# Altium project ETR_CELLMETER_MASTER.PrjPcb (part 1 of 3)
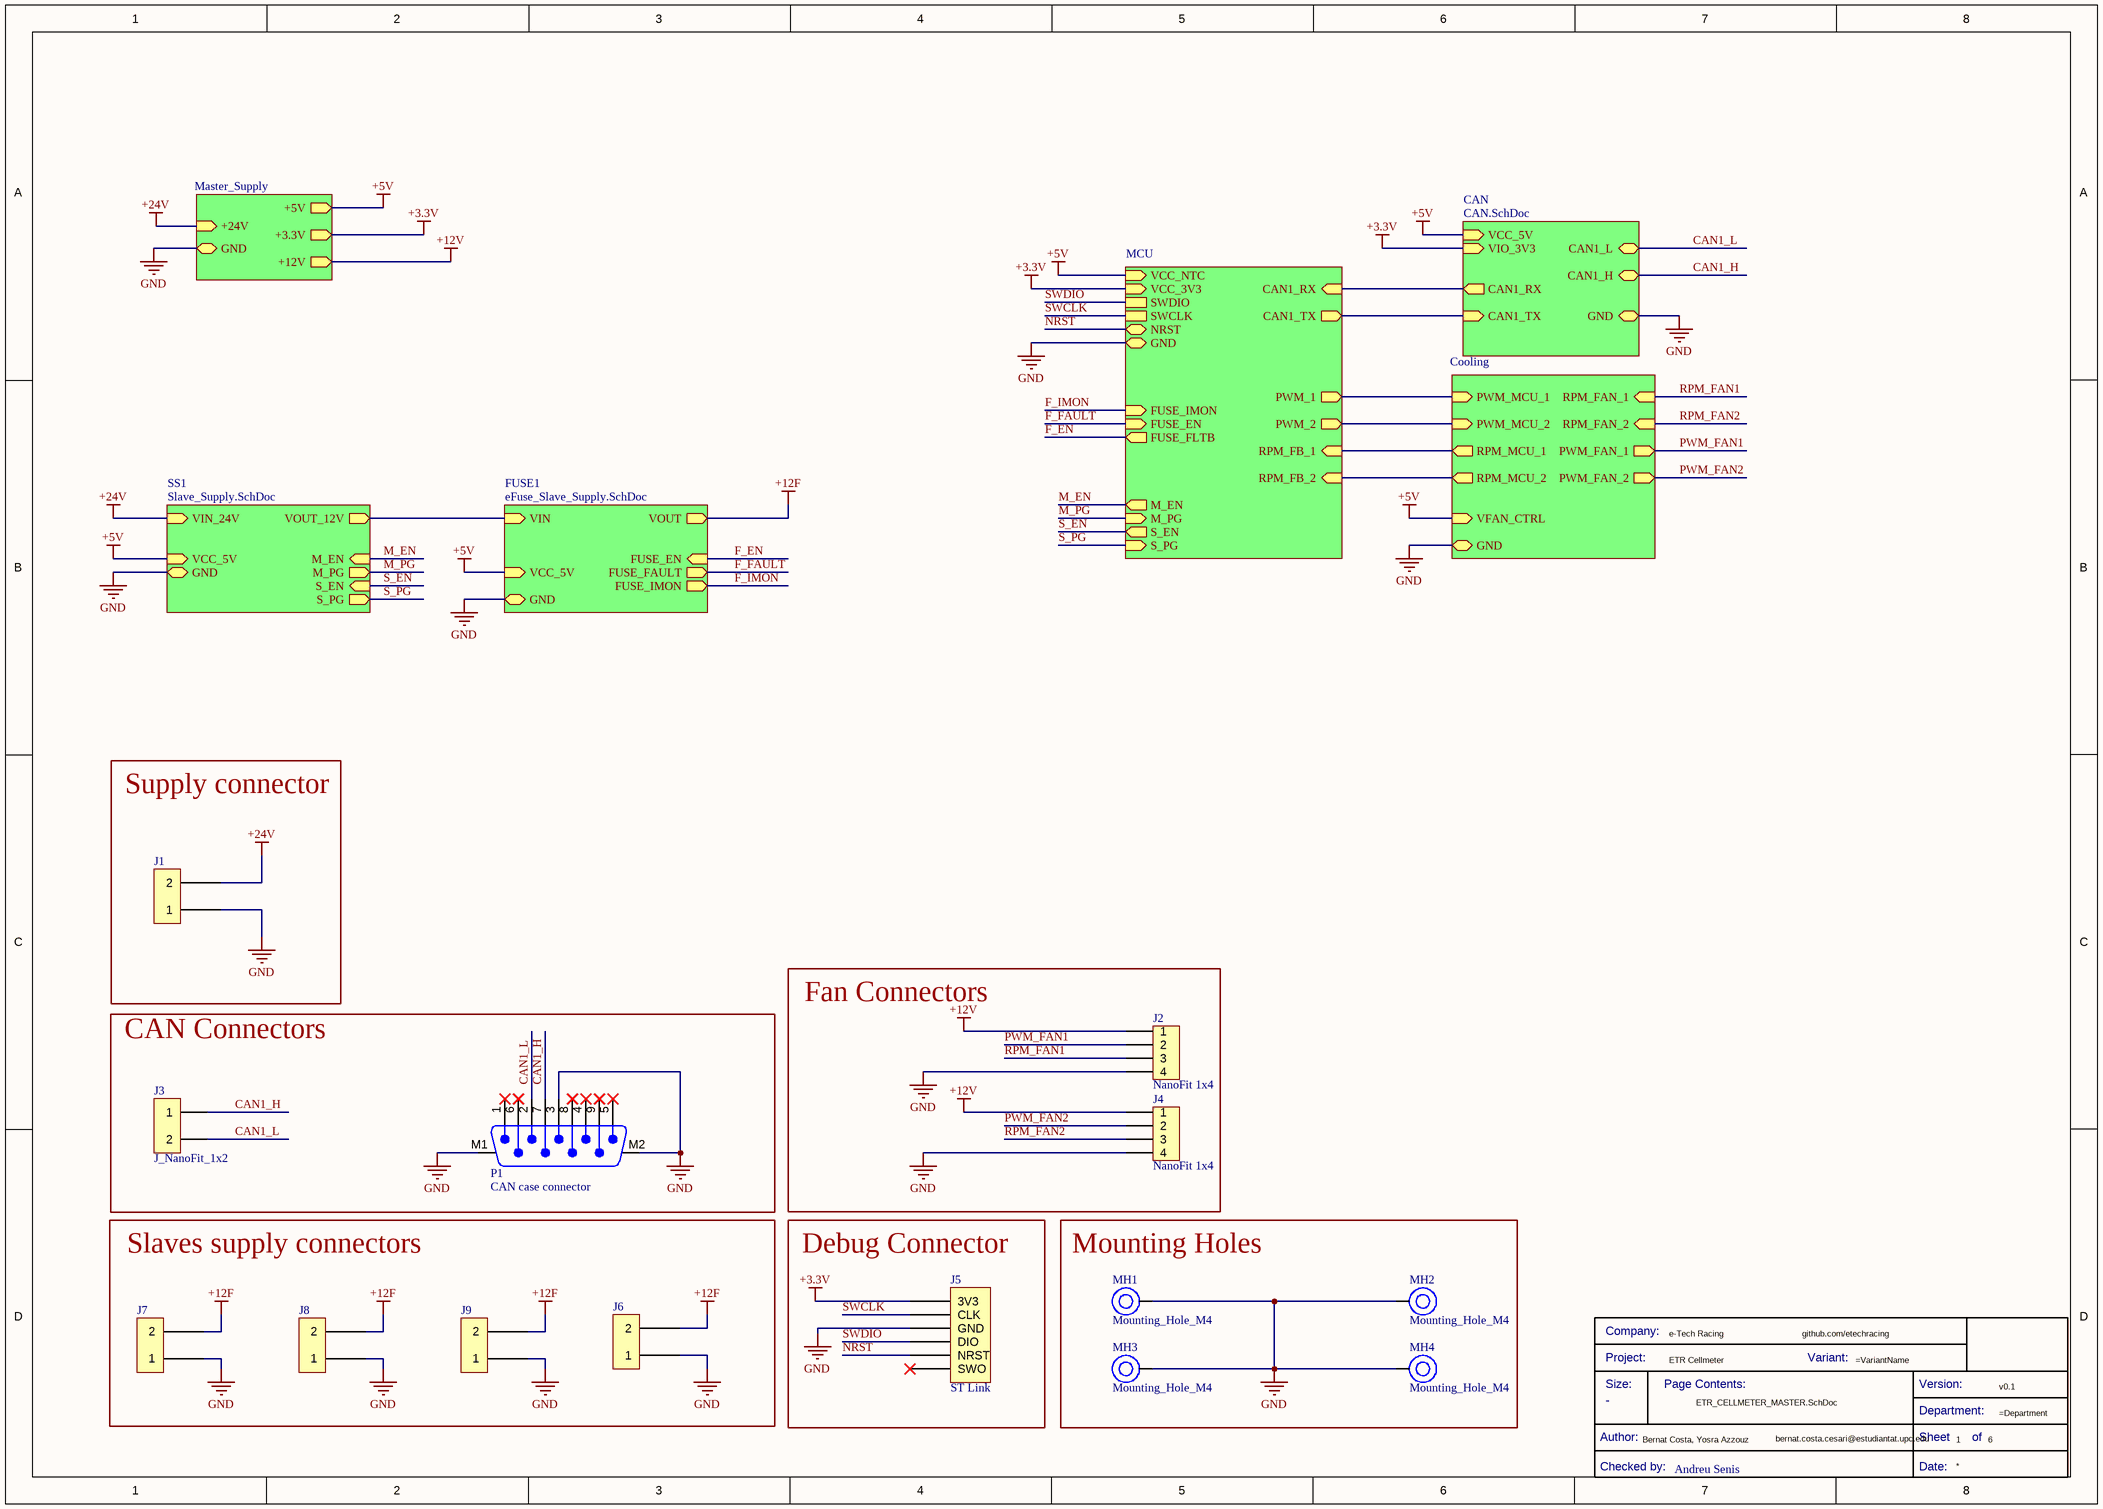
[diagram p0: ETR_CELLMETER_MASTER.SchDoc]
Company: e-Tech Racing; Date: 22/09/2024; Departament: ECUs; DesignedByURL: github.com/etechracing; DesignerMail: bernat.costa.cesari@estudiantat.upc.edu; DesignerName: Bernat Costa, Yosra Azzouz; Project: ETR Cellmeter; ReviewerName: Andreu Senis; Size: A4; Variant: 0; Version: v0.1
7 sheets, 188 parts. Net scope: strictly hierarchical (ports join the sheet entries above them; power ports are local).
Board file: ETR_CELLMETER_MASTER.PcbDoc
Sheets:
  ETR_CELLMETER_MASTER.SchDoc
    Master_Supply = Master_Supply.SchDoc
    MCU = MCU.SchDoc
    Cooling = Cooling.SchDoc
    SS1 = Slave_Supply.SchDoc
    FUSE1 = eFuse_Slave_Supply.SchDoc
    CAN = CAN.SchDoc

## Sheet ETR_CELLMETER_MASTER.SchDoc
size A3; DocumentNumber: 1; SheetNumber: 1; SheetTotal: 6

### Parts
(Parts that share a designator on the sheet are numbered #1, #2 ... from top to bottom, then left to right.)
*#1  Checked by:: Andreu Senis  (hidden comment: Title Block_template)  (graphical)
J1  J_2x1_14A_TE  [179838-2]  (value not drawn)
J2  NanoFit 1x4  [J_NanoFit_1x4_V]
J3  J_NanoFit_1x2  [FP-105309-1102-MFG]
J4  NanoFit 1x4  [J_NanoFit_1x4_V]
J5  ST Link  [J_STLink_PinHeader]
J6  J_2x1_14A_TE  [179838-2]  (value not drawn)
J7  J_2x1_14A_TE  [179838-2]  (value not drawn)
J8  J_2x1_14A_TE  [179838-2]  (value not drawn)
J9  J_2x1_14A_TE  [179838-2]  (value not drawn)
MH1  Mounting_Hole_M4  [Mounting_Hole_M4]
MH2  Mounting_Hole_M4  [Mounting_Hole_M4]
MH3  Mounting_Hole_M4  [Mounting_Hole_M4]
MH4  Mounting_Hole_M4  [Mounting_Hole_M4]
P1  CAN case connector  [618009231221]

### Blocks framed on the sheet
Supply connector: J1
Fan Connectors: J2 J4
CAN Connectors: J3 P1
Slaves supply connectors: J6-J9
Debug Connector: J5
Mounting Holes: MH1-MH4

### Sub-sheets
CAN = CAN.SchDoc: CAN1_L (bidir), CAN1_H (bidir), VCC_5V (in), VIO_3V3 (in), CAN1_RX (out), CAN1_TX (in), GND (bidir)
Cooling = Cooling: PWM_MCU_1 (in), PWM_MCU_2 (in), PWM_FAN_1 (out), PWM_FAN_2 (out), RPM_FAN_1 (in), RPM_FAN_2 (in), RPM_MCU_1 (out), RPM_MCU_2 (out), VFAN_CTRL (in), GND (bidir)
FUSE1 = eFuse_Slave_Supply.SchDoc: VIN (in), VOUT (out), FUSE_EN (in), FUSE_FAULT (out), FUSE_IMON (out), VCC_5V (in), GND (bidir)
Master_Supply = Master_Supply: +24V (in), +5V (out), +3.3V (out), +12V (out), GND (bidir)
MCU = MCU: VCC_3V3 (in), SWDIO, SWCLK, PWM_1 (out), PWM_2 (out), RPM_FB_1 (in), RPM_FB_2 (in), CAN1_TX (out), CAN1_RX (in), NRST (bidir), GND (bidir), VCC_NTC (in), M_EN (out), M_PG (in), S_EN (out), S_PG (in), FUSE_IMON (in), FUSE_EN (in), FUSE_FLTB (out)
SS1 = Slave_Supply.SchDoc: VIN_24V (in), VOUT_12V (out), VCC_5V (in), GND (bidir), M_PG (out), M_EN (in), S_PG (out), S_EN (in)

### Nets
+3.3V: J5.1(3V3) ; sheet Master_Supply/+3.3V, sheet MCU/VCC_3V3, sheet CAN/VIO_3V3
+5V: sheet Master_Supply/+5V, sheet MCU/VCC_NTC, sheet Cooling/VFAN_CTRL, sheet SS1/VCC_5V, sheet FUSE1/VCC_5V, sheet CAN/VCC_5V  [project net +5]
+12F: J6.2 J7.2 J8.2 J9.2 ; sheet FUSE1/VOUT
+12S: sheet SS1/VOUT_12V, sheet FUSE1/VIN
+12V: J2.1 J4.1 ; sheet Master_Supply/+12V  [project net +12]
+24V: J1.2 ; sheet Master_Supply/+24V, sheet SS1/VIN_24V  [project net +24]
GND: J1.1 J2.4 J4.4 J5.3(GND) J6.1 J7.1 J8.1 J9.1 MH1.1 MH2.1 MH3.1 MH4.1 P1.3 P1.M1 P1.M2 ; sheet Master_Supply/GND, sheet MCU/GND, sheet Cooling/GND, sheet SS1/GND, sheet FUSE1/GND, sheet CAN/GND
CAN1_H: J3.1 P1.7 ; sheet CAN/CAN1_H
CAN1_L: J3.2 P1.2 ; sheet CAN/CAN1_L
F_EN: sheet MCU/FUSE_FLTB, sheet FUSE1/FUSE_EN
F_FAULT: sheet MCU/FUSE_EN, sheet FUSE1/FUSE_FAULT
F_IMON: sheet MCU/FUSE_IMON, sheet FUSE1/FUSE_IMON
M_EN: sheet MCU/M_EN, sheet SS1/M_EN
M_PG: sheet MCU/M_PG, sheet SS1/M_PG
NRST: J5.5(NRST) ; sheet MCU/NRST
PWM_FAN1: J2.2 ; sheet Cooling/PWM_FAN_1
PWM_FAN2: J4.2 ; sheet Cooling/PWM_FAN_2
RPM_FAN1: J2.3 ; sheet Cooling/RPM_FAN_1
RPM_FAN2: J4.3 ; sheet Cooling/RPM_FAN_2
S_EN: sheet MCU/S_EN, sheet SS1/S_EN
S_PG: sheet MCU/S_PG, sheet SS1/S_PG
SWCLK: J5.2(CLK) ; sheet MCU/SWCLK
SWDIO: J5.4(DIO) ; sheet MCU/SWDIO
NetQ301_G: sheet MCU/PWM_1, sheet Cooling/PWM_MCU_1
NetQ302_G: sheet MCU/PWM_2, sheet Cooling/PWM_MCU_2
NetR301_1: sheet MCU/RPM_FB_1, sheet Cooling/RPM_MCU_1
NetR304_1: sheet MCU/RPM_FB_2, sheet Cooling/RPM_MCU_2
NetU201_70: sheet MCU/CAN1_TX, sheet CAN/CAN1_TX
NetU201_71: sheet MCU/CAN1_RX, sheet CAN/CAN1_RX

Not connected (* = marked no-connect by the designer): J5 6(SWO)*; P1 1* 4* 5* 6* 8* 9*

### Notes on the sheet
- THIS DOCUMENT AND THE DATA DISCLOSED HEREIN OR
- HEREWITH IS THE PROPERTY OF ALTIUM LIMITED AND MAY
- DWG NO:
- REVISION
- REV:
- DESCRIPTION
- DATE
- APPROVED
- BE FREELY DISTRIBUTED IN WHOLE. NO RIGHTS ARE
- RESERVED OR EXPRESS OR IMPLIED WARANTEE GIVEN.
- ENG:
- APPROVALS
- PROJECT
- DSN:
- CHK:
- REFERENCE DOCUMENTS
- PROJECT REVISION:
- TITLE
- DOCUMENT REVISION:
- DESIGN ITEM:
- BOM:
- FAB DWG:
- PCB DWG:
- ASSY DWG:
- SCALE:
- A3
- SIZE
- CAGE CODE
- FILE NAME
- DWG NO.
- SHEET
- OF
- REV
- (in symbol Title Block_template) Company:; Project:; Variant:; Size:; Page Contents:; Version:; Department:; Author:; Sheet; of; Checked by:; Date:

### Library data of the parts
*#1 = Title Block_template: Standard Title Block; .Creator: GP; Category: Title Block; .PCBcheck: GP; .SCHcheck: GP; Size: -
J1 J6-J9 = CMP-002-00003-2: 179838-2; Connector Type: Power,Rectangular; Design Item ID: Power 2 pin connector; Mounting Technology: Board; RoHS Compliant: Yes; Max Operating Temperature: 105°C; Source: Electromechanical.SchLib; Min Operating Temperature: -30°C
J2 J4 = CMP-00027-1: Conn HDR 4 POS 2.5mm Solder ST Thru-Hole 4 Terminal 1 Port Nano-Fit Tray; Manufacturer Part Number 1: 105309-2104; Manufacturer 1: Molex; .Creator: DR; Stock 1: 1183; RoHS: No; Category: Headers and Wire Housings; Source: Electromechanical.SchLib; Design Item ID: J_NanoFit_1x4_V_W; Pricing 1: 1=1,30000, 10=1,15000, 25=1,11000, 50=1,07000, 100=1,02000, 250=0,94400 (USD)
J3 = CMP-002-00001-2: Conn HDR 2 POS 2.5mm Solder ST Thru-Hole 2 Terminal 1 Port Nano-Fit Tray
J5 = J_STLink_STM32_PinHeader_1x6
MH1-MH4 = CMP-00041-6: Mounting Hole M4; Source: Electromechanical.SchLib; Design Item ID: Mounting_Hole_M4
P1 = CMP-002-00005-1: D Type Connector, 9 Contact(s), Male, Solder Terminal, Locking, Receptacle; RoHS Compliant: Yes; Max Operating Temperature: 85°C; Mounting Technology: Board; Min Operating Temperature: -40°C

## Sheet Master_Supply.SchDoc
size A3; DocumentNumber: 2; SheetNumber: 2; SheetTotal: 6; SPICEModelCache: <root> / <DocumentId>HJHAZPGP</DocumentId> / <CacheFrame Number="0"> / <Model Name="865080545011_68uf" Kind="CKT"> / <Text>******* / .subckt 865080545011_68uF 1 2 / Rser 1 3 0.375 / Lser 2 4 0.000000002608 / C1 3 4 0.000068 / Rpar 3 4 1470588.23529412 / .ends 865080545011_68uF</Text> / </Model> / </CacheFrame> / </root>
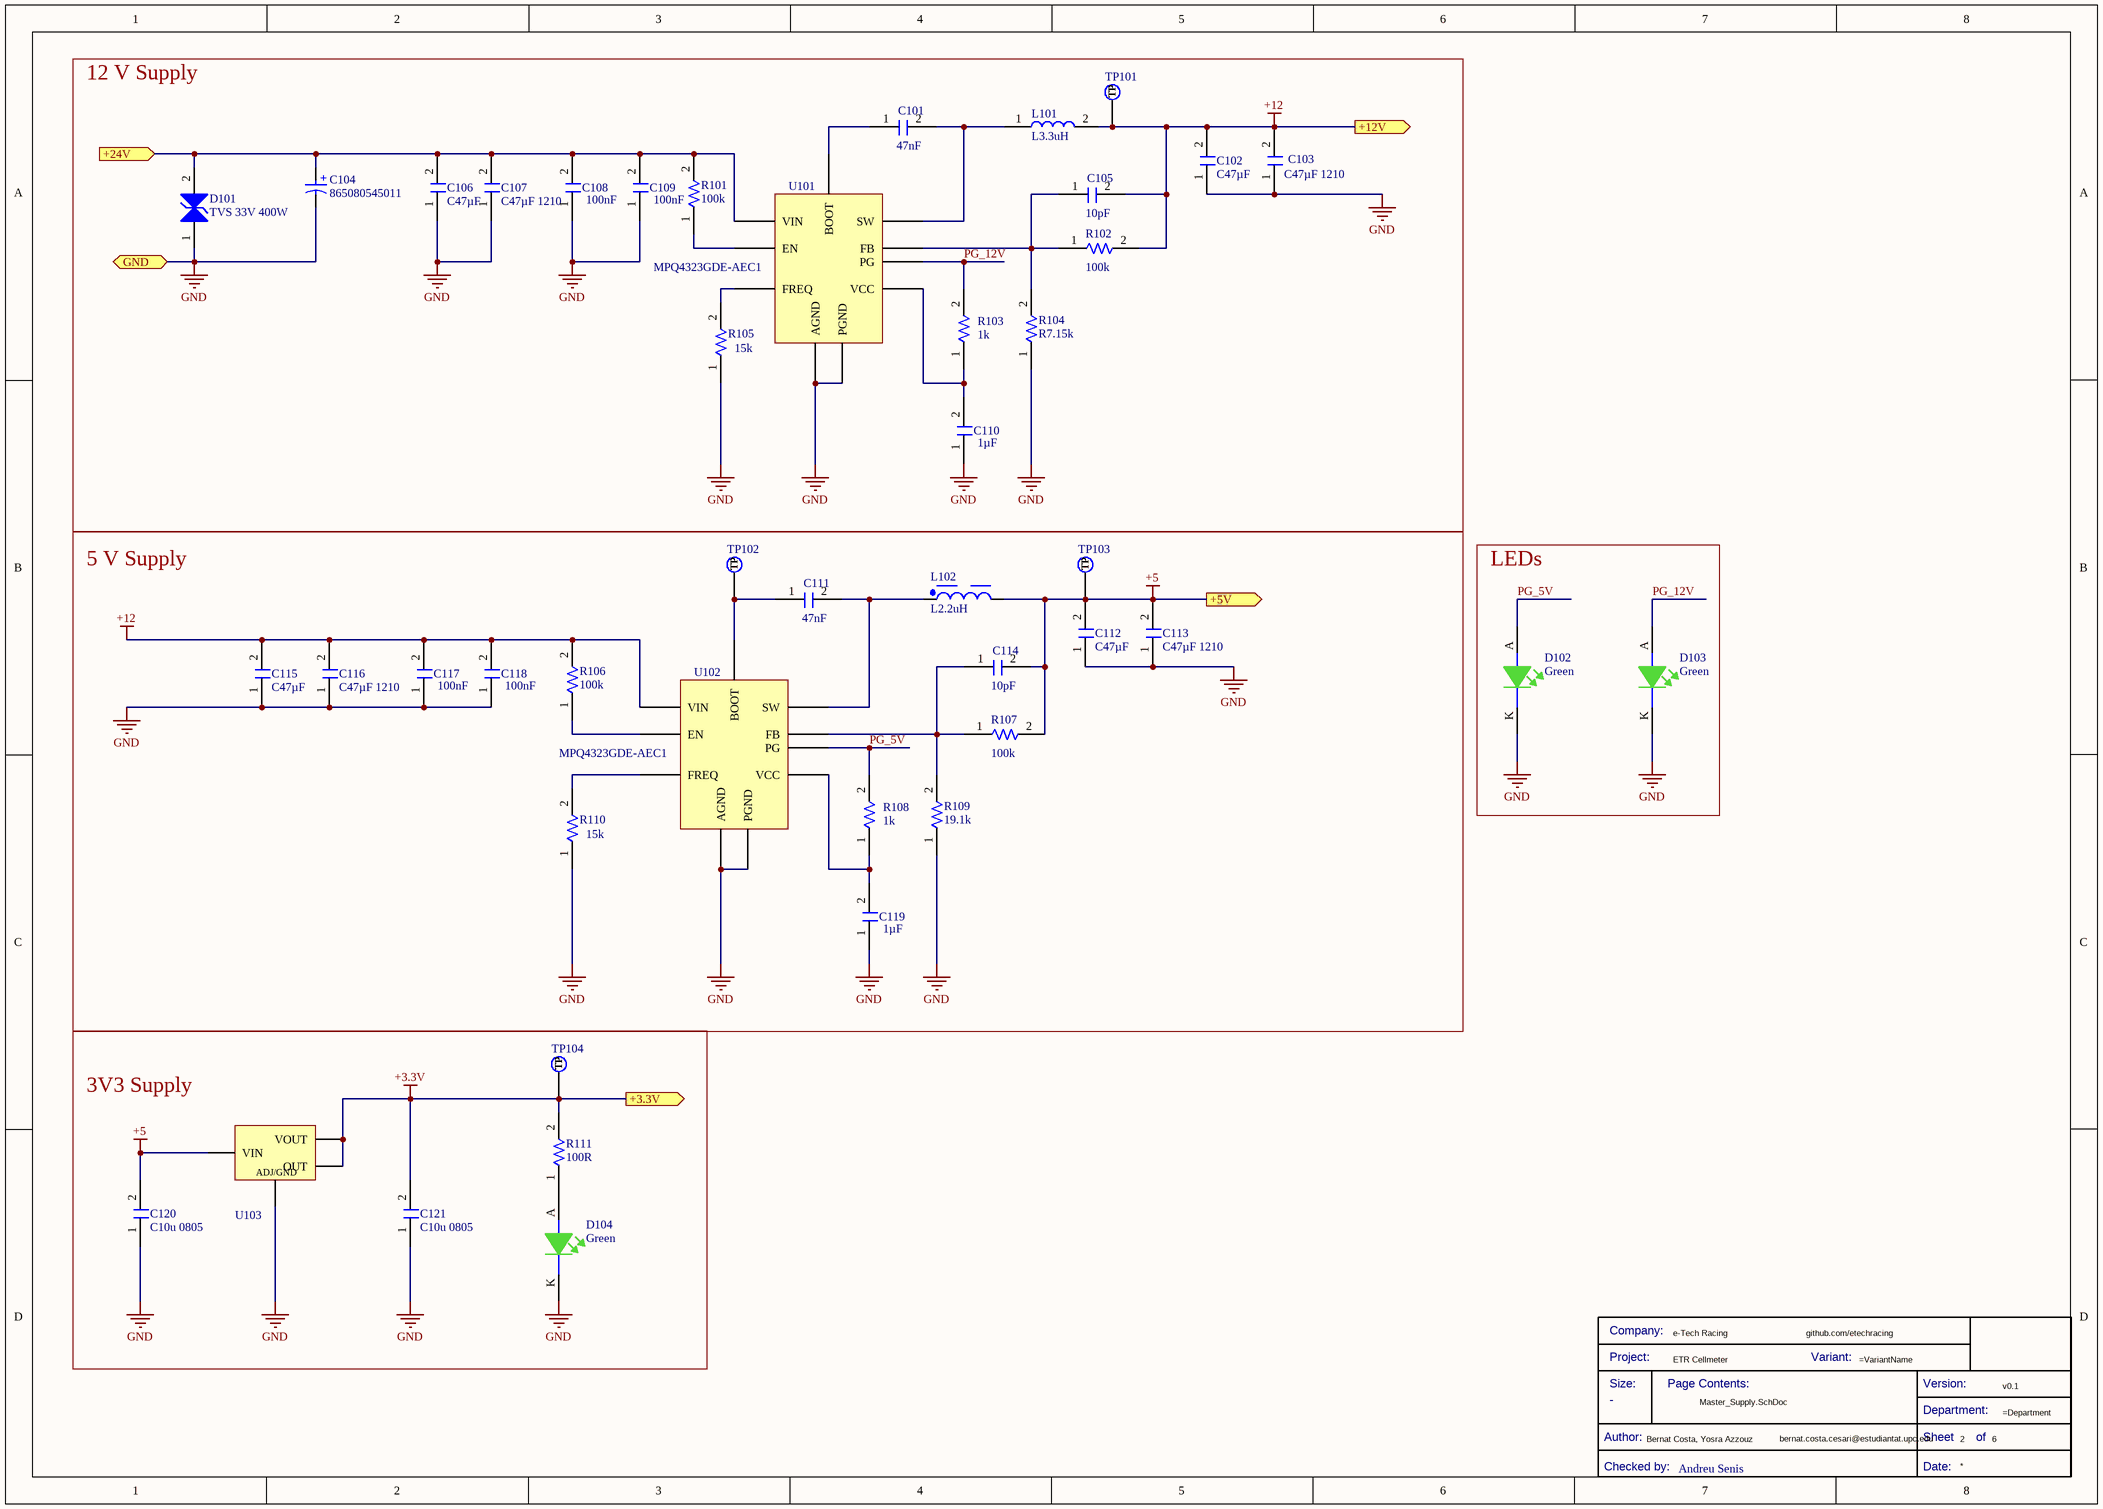
[diagram p1: Master_Supply.SchDoc]

### Parts
(Parts that share a designator on the sheet are numbered #1, #2 ... from top to bottom, then left to right.)
*#2  Checked by:: Andreu Senis  (hidden comment: Title Block_template)  (graphical)
C101  value 47nF  [WCAP-CSGP_0805_L2W1.25H0.8_Reflow]  (hidden comment: C47nF_0805)
C102  C47µF  [FP-GRM32E-0_3-0_2-IPC_C]
C103  C47µF 1210  [FP-GRM32E-0_3-0_2-IPC_C]
C104  865080545011  [WCAP-ASLI_D6.3H7.7]
C105  value 10pF  [WCAP-CSGP_0805_L2W1.25H0.6_Reflow]  (hidden comment: 885012007051)
C106  C47µF  [FP-GRM32E-0_3-0_2-IPC_C]
C107  C47µF 1210  [FP-GRM32E-0_3-0_2-IPC_C]
C108  value 100nF  [C0805FNPC-R]  (hidden comment: C100n-50V-0805FNPC-X7R)
C109  value 100nF  [C0805FNPC-R]  (hidden comment: C100n-50V-0805FNPC-X7R)
C110  value 1µF  [C0805FNPC-R]  (hidden comment: C1u-50V-0805FNPC-X7R)
C111  value 47nF  [WCAP-CSGP_0805_L2W1.25H0.8_Reflow]  (hidden comment: 885012207096)
C112  C47µF  [FP-GRM32E-0_3-0_2-IPC_C]
C113  C47µF 1210  [FP-GRM32E-0_3-0_2-IPC_C]
C114  value 10pF  [WCAP-CSGP_0805_L2W1.25H0.6_Reflow]  (hidden comment: C10pF_0805_50V)
C115  C47µF  [FP-GRM32E-0_3-0_2-IPC_C]
C116  C47µF 1210  [FP-GRM32E-0_3-0_2-IPC_C]
C117  value 100nF  [C0805FNPC-R]  (hidden comment: C100n-50V-0805FNPC-X7R)
C118  value 100nF  [C0805FNPC-R]  (hidden comment: C100n-50V-0805FNPC-X7R)
C119  value 1µF  [C0805FNPC-R]  (hidden comment: C1u-50V-0805FNPC-X7R)
C120  C10u 0805  [C0805FNPC-R]
C121  C10u 0805  [C0805FNPC-R]
D101  TVS 33V 400W  [WE-TVSP_DO-214AC_Bidirectional]
D102  Color: Green  [LED_0805_WE]  (hidden comment: 150080VS75000)
D103  Color: Green  [LED_0805_WE]  (hidden comment: 150080VS75000)
D104  Color: Green  [LED_0805_WE]  (hidden comment: 150080VS75000)
L101  L3.3uH  [WE-PD_7345]
L102  L2.2uH  [WE-PD_7345]
R101  value 100k  [RESC2013X70X40NL20T20]  (hidden comment: R100k-0805)
R102  value 100k  [RESC2013X70X40NL20T20]  (hidden comment: R100k-0805)
R103  value 1k  [R0805FTK]  (hidden comment: R1k-0805FTK)
R104  R7.15k  [FP-RN732A-IPC_B]
R105  value 15k  [RESC2013X50X30ML20T20]  (hidden comment: R15K-0805)
R106  value 100k  [RESC2013X70X40NL20T20]  (hidden comment: R100k-0805)
R107  value 100k  [RESC2013X70X40NL20T20]  (hidden comment: R100k-0805)
R108  value 1k  [R0805FTK]  (hidden comment: R1k-0805FTK)
R109  value 19.1k  [0805]  (hidden comment: R19.1k_0805)
R110  value 15k  [RESC2013X50X30ML20T20]  (hidden comment: R15K-0805)
R111  Resistance: 100R  [R0805FTK]  (hidden comment: CR0805-FX-1000ELF)
TP101  TestPoint  [TestPoint]  (value not drawn)  (no BOM)
TP102  TestPoint  [TestPoint]  (value not drawn)  (no BOM)
TP103  TestPoint  [TestPoint]  (value not drawn)  (no BOM)
TP104  TestPoint  [TestPoint]  (value not drawn)  (no BOM)
U101  MPQ4323GDE-AEC1  [MPQ4323]
U102  MPQ4323GDE-AEC1  [MPQ4323]
U103  LM1117IMP-3.3/NOPB  [LDO_10V-0.8/3V3-SOT223]  (value not drawn)

### Blocks framed on the sheet
12 V Supply: C101-C110 D101 L101 R101-R105 TP101 U101
5 V Supply: C111-C119 L102 R106-R110 TP102 TP103 U102
LEDs: D102 D103
3V3 Supply: C120 C121 D104 R111 TP104 U103

### Ports
+3.3V (out), +5V (out), +12V (out), +24V (in), GND (bidir)

### Nets
+3.3V: C121.2 R111.2 TP104.1(TP) U103.2(OUT) U103.4(VOUT) ; port +3.3V
+5: C112.2 C113.2 C114.2 C120.2 L102.2 R107.2 TP103.1(TP) U103.3(VIN) ; port +5V
+12: C102.2 C103.2 C105.2 C115.2 C116.2 C117.2 C118.2 L101.2 R102.2 R106.2 TP101.1(TP) U102.1(VIN) ; port +12V
+24: C104.1(P) C106.2 C107.2 C108.2 C109.2 D101.2 R101.2 U101.1(VIN) ; port +24V
GND: C102.1 C103.1 C104.2(N) C106.1 C107.1 C108.1 C109.1 C110.1 C112.1 C113.1 C115.1 C116.1 C117.1 C118.1 C119.1 C120.1 C121.1 D101.1 D102.K D103.K D104.K R104.1 R105.1 R109.1 R110.1 U101.4(AGND) U101.5(PGND) U102.4(AGND) U102.5(PGND) U103.1(ADJ/GND) ; port GND
PG_5V: D102.A R108.2 U102.7(PG)
PG_12V: D103.A R103.2 U101.7(PG)
NetC101_1: C101.1 U101.10(BOOT)
NetC101_2: C101.2 L101.1 U101.9(SW)
NetC105_1: C105.1 R102.1 R104.2 U101.8(FB)
NetC110_2: C110.2 R103.1 U101.6(VCC)
NetC111_1: C111.1 TP102.1(TP) U102.10(BOOT)
NetC111_2: C111.2 L102.1 U102.9(SW)
NetC114_1: C114.1 R107.1 R109.2 U102.8(FB)
NetC119_2: C119.2 R108.1 U102.6(VCC)
NetD104_A: D104.A R111.1
NetR101_1: R101.1 U101.2(EN)
NetR105_2: R105.2 U101.3(FREQ)
NetR106_1: R106.1 U102.2(EN)
NetR110_2: R110.2 U102.3(FREQ)

### Notes on the sheet
- (in symbol CMP-002-00006-1) +
- (in symbol Title Block_template) Company:; Project:; Variant:; Size:; Page Contents:; Version:; Department:; Author:; Sheet; of; Checked by:; Date:

### Library data of the parts
*#2 = Title Block_template: Standard Title Block; .Creator: GP; Category: Title Block; .PCBcheck: GP; .SCHcheck: GP; Size: -
C101 = CMP-001-00011-2: Ceramic Capacitor, Ceramic. 885012207096; Capacitor Type: Ceramic; Pins: 2; RoHS Compliant: Yes
C102 C103 C106 C107 C112 C113 C115 C116 = CMP-001-00003-2: Ceramic Capacitor, Multilayer, Ceramic, 10V, 10% +Tol, 10% -Tol, X6S, 22% TC, 47uF, Surface Mount, 1210; Value: 47µF; Case/Package: 1210; RoHS Compliant: Yes; Min Operating Temperature: -55°C; Capacitor Type: Ceramic; Max Operating Temperature: 105°C; Mounting Technology: Surface Mount; Pins: 2
C104 = CMP-002-00006-1: WCAP-ASLI Aluminum Electrolytic Capacitor, V-Chip, D6.3 x H7.7mm, 68uF, 35V; Manufacturer: Wurth Elektronik; Technical Reference: ASED077680M035DVCTCB000; Capacitance Tolerance: +/-20%; Value: 68µF; Dissipation Factor: 14%; Ripple Current: 265mA; Endurance: 2000h; Leakage Current: 23.8uA; Mount: Surface Mount; ComponentLink2URL: https://www.we-online.com/redexpert/spec/865080545011?ad; ComponentLink2Description: Datasheet Link; Operating Temperature Max: 105°C; ComponentLink1URL: https://www.we-online.com/redexpert/article/865080545011?ad; Height: 7.7mm; Rated Voltage (DC): 35V; Component Type: Standard; Pins: 2; Match Code: WCAP-ASLI; Source: WCAP-ASLI.SchLib; Design Item ID: 865080545011; Operating Temperature Min: -55°C; Diameter: 6.3mm; Packaging: Tape and Reel; Manufacturer Part Number: 865080545011; Category: Aluminum Electrolytic Capacitors; ComponentLink1Description: Website Link
C105 = CMP-001-00012-1: Ceramic Capacitor, Multilayer, Ceramic, 50V, 5% +Tol, 5% -Tol, C0G, 30ppm/Cel TC, 0.00001uF, Surface Mount, 0805; Pins: 2; Capacitor Type: Ceramic; RoHS Compliant: Yes
C108 C109 C117 C118 = CMP-00063-1: Cap, 0.1ΜF, 50V, 10%, X7R, 0805; Manufacturer 1: Wurth Electronics; Manufacturer Part Number 1: 885012207098; .Creator: DR; Pricing 1: 100=0,10200, 500=0,07100, 2000=0,06100 (GBP); ComponentLink1URL: http://www.farnell.com/datasheets/1958498.pdf?src-supplier=Farnell; Design Item ID: C100n-50V-0805FNPC-X7R; Voltage Rating (DC): 50V; Voltage Rating: 50V; Max Operating Temperature: 125°C; RoHS: Yes; Case Code (Metric): 2012; Mount: Surface Mount; REACH SVHC: Unknown; Stock 1: 8000; Source: Passives.SchLib; Tolerance: 10%; RoHS Compliant: Yes; Dielectric: X7R; ComponentLink2Description: http://www.farnell.com/datasheets/1958498.pdf?src-supplier=Element14; ComponentLink2URL: http://www.farnell.com/datasheets/1958498.pdf?src-supplier=Element14; Min Operating Temperature: -55°C; Width: 0.049inch; Category: Ceramic Capacitors; Thickness: 0.035inch; Length: 0.079inch; ComponentLink3URL: https://katalog.we-online.de/pbs/datasheet/885012207098.pdf?src-supplier=Digi-Key; Case/Package: 0805; ComponentLink3Description: https://katalog.we-online.de/pbs/datasheet/885012207098.pdf?src-supplier=Digi-Key; Packaging: Cut Tape; ComponentLink1Description: http://www.farnell.com/datasheets/1958498.pdf?src-supplier=Farnell; ComponentLink4Description: http://www.farnell.com/datasheets/1958498.pdf?src-supplier=Newark; ComponentLink4URL: http://www.farnell.com/datasheets/1958498.pdf?src-supplier=Newark
C110 C119 = CMP-00052-1: Multilayer Ceramic Capacitor, Wcap-Csgp Series, 1 F, 10%, X7R, 50 V, 0805 [2012 Metric] Rohs Compliant: Yes; Manufacturer Part Number 1: 885012207103; Manufacturer 1: Wurth Electronics; Voltage Rating (DC): 50V; .Creator: GP; Max Operating Temperature: 85°C; Case/Package: 0805; ComponentLink1Description: http://www.farnell.com/datasheets/1958501.pdf?src-supplier=Farnell; Design Item ID: C1u-50V-0805FNPC-X7R; ComponentLink1URL: http://www.farnell.com/datasheets/1958501.pdf?src-supplier=Farnell; ComponentLink2Description: http://www.farnell.com/datasheets/1958501.pdf?src-supplier=Element14; ComponentLink3URL: https://katalog.we-online.de/pbs/datasheet/885012107003.pdf?src-supplier=Digi-Key; ComponentLink4Description: http://www.farnell.com/datasheets/1958501.pdf?src-supplier=Newark; Width: 0.049inch; RoHS Compliant: Yes; Case Code (Metric): 2012; Source: Passives.SchLib; Category: Ceramic Capacitors; Tolerance: 10%; Pricing 1: 50=0,27200, 250=0,25300, 500=0,22800, 1250=0,20100, 2500=0,17100 (GBP); RoHS: Yes; Mount: Surface Mount; Min Operating Temperature: -55°C; ComponentLink4URL: http://www.farnell.com/datasheets/1958501.pdf?src-supplier=Newark; Dielectric: X7R; ComponentLink3Description: https://katalog.we-online.de/pbs/datasheet/885012107003.pdf?src-supplier=Digi-Key; ComponentLink2URL: http://www.farnell.com/datasheets/1958501.pdf?src-supplier=Element14; REACH SVHC: Unknown; Length: 0.079inch; Packaging: Cut Tape; Thickness: 0.053inch; Stock 1: 5100; Voltage Rating: 50V
C111 = CMP-001-00011-1: Ceramic Capacitor, Ceramic; RoHS Compliant: Yes; Capacitor Type: Ceramic; Pins: 2
C114 = CMP-001-00012-2: Ceramic Capacitor, Multilayer, Ceramic, 50V, 5% +Tol, 5% -Tol, C0G, 30ppm/Cel TC, 0.00001uF, Surface Mount, 0805. 885012007051; Pins: 2; RoHS Compliant: Yes; Capacitor Type: Ceramic
C120 C121 = CMP-00055-6: Multilayer Ceramic Capacitor, Wcap-Csgp Series, 10 F, 20%, X5R, 16 V, 0805 [2012 Metric] Rohs Compliant: Yes; Manufacturer 1: Wurth Electronics; Manufacturer Part Number 1: 885012107014; .Creator: DR; Voltage Rating: 16V; Value: 10µF; Max Operating Temperature: 85°C; Stock 1: 81550; Pricing 1: 50=0,21000, 250=0,20200, 500=0,19100, 1000=0,17400, 2500=0,14700 (GBP); Length: 0.079inch; Dielectric: X5R; ComponentLink3Description: https://katalog.we-online.de/pbs/datasheet/885012107014.pdf?src-supplier=Digi-Key; RoHS: Yes; ComponentLink2URL: http://www.farnell.com/datasheets/1958454.pdf?src-supplier=Element14; ComponentLink1URL: http://www.farnell.com/datasheets/1958454.pdf?src-supplier=Farnell; Width: 0.049inch; Min Operating Temperature: -55°C; REACH SVHC: Unknown; Source: Passives.SchLib; ComponentLink1Description: http://www.farnell.com/datasheets/1958454.pdf?src-supplier=Farnell; Category: Ceramic Capacitors; ComponentLink2Description: http://www.farnell.com/datasheets/1958454.pdf?src-supplier=Element14; Case Code (Metric): 2012; Case/Package: 0805; Packaging: Cut Tape; ComponentLink4URL: http://www.farnell.com/datasheets/1958454.pdf?src-supplier=Newark; RoHS Compliant: Yes; Thickness: 0.057inch; Design Item ID: C10u-16V-0805FNPC-X5R; ComponentLink4Description: http://www.farnell.com/datasheets/1958454.pdf?src-supplier=Newark; Tolerance: 20%; Mount: Surface Mount; ComponentLink3URL: https://katalog.we-online.de/pbs/datasheet/885012107014.pdf?src-supplier=Digi-Key; Voltage Rating (DC): 16V
D101 = CMP-004-00003-1: Trans Voltage Suppressor Diode, 400W, Bidirectional, 1 Element, Silicon, DO-214AC; Min Operating Temperature: -65°C; Pins: 2; RoHS Compliant: Yes; Max Operating Temperature: 150°C
D102-D104 = LEDVS-0805-40: Led, Green, 570 Nm, 2 V, 30 Ma, 40 Mcd Rohs Compliant: Yes; Manufacturer 1: Wurth Electronics; Luminous Intensity: 40mcd; Forward Current: 30mA; Forward Voltage: 2V; Viewing Angle: 140°; Wavelength: 570nm; Lens Style: Clear,Rectangular; Test Current: 20mA; .Creator: DR; ComponentLink1Description: Datasheet; ComponentLink1URL: https://www.we-online.com/catalog/datasheet/150080VS75000.pdf; ComponentLink2Description: Where buy it; ComponentLink2URL: https://katalog.we-online.de/en/led/WL-SMCW/150080VS75000; Supplier 1: RSComponents; Manufacturer Part Number 1: 150080VS75000; RoHS: Yes; Category: LEDs; Stock 1: 850; Pricing 1: 50=0,19300, 500=0,12900, 1000=0,12300, 2000=0,11700, 4000=0,11100 (USD); Mount: Surface Mount; Case/Package: 0805; Case Code (Metric): 2012; Case Code (Imperial): 0805; Min Operating Temperature: -40°C; Max Operating Temperature: 85°C; Package Quantity: 4000; Packaging: Tape and Reel; Dominant Wavelength: 570nm; Length: 2mm; Width: 1.25mm; Height: 0.7mm; REACH SVHC: Unknown; ComponentLink3URL: https://datasheet.ciiva.com/22656/150080vs75000-22656966.pdf?src-supplier=Element14; ComponentLink3Description: https://datasheet.ciiva.com/22656/150080vs75000-22656966.pdf?src-supplier=Element14; ComponentLink4URL: https://datasheet.ciiva.com/29279/759437-da-01-en-chipled-0805-w-kl-h-gruen-150080vs7500-29279047.pdf?src-supplier=Conrad; ComponentLink4Description: https://datasheet.ciiva.com/29279/759437-da-01-en-chipled-0805-w-kl-h-gruen-150080vs7500-29279047.pdf?src-supplier=Conrad; ComponentLink5URL: https://datasheet.ciiva.com/29563/150080vs75000-29563018.pdf?src-supplier=Digi-Key; ComponentLink5Description: https://datasheet.ciiva.com/29563/150080vs75000-29563018.pdf?src-supplier=Digi-Key; Supplier Part Number 1: 8154237
L101 = CMP-006-00002-2: General Purpose Inductor, 3.3uH, 20%, 1 Element, Ferrite-Core, SMD. 744777003; Max Current Rating: 5A; Self Resonant Frequency: 55MHz; Max Operating Temperature: 125°C; RoHS Compliant: Yes; Pins: 2; Tolerance: 20%; Min Operating Temperature: -40°C
L102 = CMP-006-00004-1: General Purpose Inductor, 2.2uH, 20%, 1 Element, Ferrite-Core, SMD. 744777002; Max Current Rating: 6A; Self Resonant Frequency: 60MHz; Pins: 2; RoHS Compliant: Yes; Tolerance: 20%; Min Operating Temperature: -40°C; Max Operating Temperature: 125°C
R101 R102 R106 R107 = CMP-009-00003-2: Fixed Resistor, Metal Glaze/thick Film, 0.125W, 100000ohm, 150V, 5% +/-Tol, 200ppm/Cel, Surface Mount, 0805; Power: 125mW; Max Operating Temperature: 155°C; Mounting Technology: Surface Mount; RoHS Compliant: Yes; Min Operating Temperature: -55°C; Pins: 2; Case/Package: 0805; Tolerance: 5%
R103 R108 = CMP-00076-1: Res Thick Film 0805 1K Ohm 5% 1/8W ±200ppm/°C Molded SMD SMD Paper Tape on Plastic Reel; Manufacturer Part Number 1: CR0805-JW-102ELF; Manufacturer 1: Bourns; Voltage Rating (DC): 150V; Power Rating: 125mW; .Creator: GP; Number of Terminations: 2; REACH SVHC: No SVHC; ComponentLink3URL: https://datasheet.ciiva.com/22693/1902866-22693253.pdf?src-supplier=Element14; ComponentLink1URL: https://datasheet.ciiva.com/11821/0900766b80fcdb72-11821134.pdf?src-supplier=RSComponents; ComponentLink1Description: https://datasheet.ciiva.com/11821/0900766b80fcdb72-11821134.pdf?src-supplier=RSComponents; Category: Chip SMD Resistors; Stock 1: 27510; Case/Package: 0805; ComponentLink3Description: https://datasheet.ciiva.com/22693/1902866-22693253.pdf?src-supplier=Element14; Length: 2mm; ComponentLink5URL: https://datasheet.ciiva.com/7985/1856384-7985867.pdf?src-supplier=Element14; ComponentLink7Description: https://datasheet.ciiva.com/6547/chpreztr-6547359.pdf?src-supplier=Digi-Key; Package Quantity: 1; Tolerance: 5%; Lead Free: Lead Free; RoHS: Yes; Contact Plating: Tin; ComponentLink2Description: https://datasheet.ciiva.com/15225/getdatasheetpartid-78155-15225381.pdf?src-supplier=Verical; ComponentLink5Description: https://datasheet.ciiva.com/7985/1856384-7985867.pdf?src-supplier=Element14; Depth: 1.25mm; Thickness: 508um; Resistor Type: Thick Film; Design Item ID: R1k-0805FTK; ComponentLink2URL: https://datasheet.ciiva.com/15225/getdatasheetpartid-78155-15225381.pdf?src-supplier=Verical; Max Operating Temperature: 155°C; ComponentLink6URL: https://datasheet.ciiva.com/30242/159chpreztr-30242765.pdf?src-supplier=Onlinecomponents.com; ComponentLink4URL: https://datasheet.ciiva.com/7986/1856384-7986184.pdf?src-supplier=Element14; Military Standard: Not; Case Code (Metric): 2012; Temperature Coefficient: 200ppm/°C; Pricing 1: 1=0,05930, 10=0,03510, 25=0,01790, 100=0,00800, 250=0,00790, 500=0,00590, 1000=0,00360, 3000=0,00350, 6000=0,00250 (USD); Min Operating Temperature: -55°C; ComponentLink7URL: https://datasheet.ciiva.com/6547/chpreztr-6547359.pdf?src-supplier=Digi-Key; Width: 1.25mm; Source: Passives.SchLib; Max Power Dissipation: 125mW; Voltage Rating: 150V; ComponentLink4Description: https://datasheet.ciiva.com/7986/1856384-7986184.pdf?src-supplier=Element14; Features: Moisture Resistant; Mount: Surface Mount; Termination: SMD/SMT; Height: 0.5mm; Radiation Hardening: No; ComponentLink6Description: https://datasheet.ciiva.com/30242/159chpreztr-30242765.pdf?src-supplier=Onlinecomponents.com; Pins: 2; Packaging: Tape and Reel
R104 = CMP-009-00014-2: Fixed Resistor, Thin Film, 0.1W, 7150ohm, 100V, 0.1% +/-Tol, 10ppm/Cel, Surface Mount, 0805; Power: 100mW; Value: 7.15k; RoHS Compliant: Yes; Tolerance: 0.1%; Mounting Technology: Surface Mount; Max Operating Temperature: 125°C; Case/Package: 0805; Min Operating Temperature: -55°C; Pins: 2
R105 R110 = CMP-009-00005-1: Fixed Resistor, Metal Glaze/thick Film, 0.125W, 15000ohm, 150V, 1% +/-Tol, 100ppm/Cel, Surface Mount, 0805; Power: 125mW; Min Operating Temperature: -55°C; Mounting Technology: Surface Mount; RoHS Compliant: No; Tolerance: 1%; Pins: 2; Max Operating Temperature: 155°C; Case/Package: 0805
R109 = CMP-009-00013-1: Fixed Resistor, Thin Film, 0.125W, 19100ohm, 100V, 0.1% +/-Tol, 15ppm/Cel, Surface Mount, 0805. ERA6APB1912V; Power: 125mW; Tolerance: 0.1%; Min Operating Temperature: -55°C; Mounting Technology: Surface Mount; Case/Package: 0805; Max Operating Temperature: 155°C; Pins: 2; RoHS Compliant: Yes
R111 = R100-0805FTK: Res Thick Film 0805 100 Ohm 1% 1/8W ±100ppm/°C Molded SMD SMD Paper Tape on Plastic Reel; Manufacturer 1: Bourns; Power Rating: 125mW; Voltage Rating: 150V; .Creator: DR; Supplier 1: Arrow Electronics; Manufacturer Part Number 1: CR0805-FX-1000ELF; RoHS: Yes; Category: Chip SMD Resistors; Stock 1: 49802; Pricing 1: 1=0,05840, 10=0,03430, 25=0,01780, 100=0,00750, 250=0,00560, 500=0,00490, 3000=0,00470 (USD); Mount: Surface Mount; Case/Package: 0805; Number of Pins: 2; Contact Plating: Tin; Case Code (Imperial): 0805; Case Code (Metric): 2012; Min Operating Temperature: -55°C; Max Operating Temperature: 155°C; Tolerance: 1%; Resistor Type: Thick Film; Temperature Coefficient: 100ppm/°C; Packaging: Tape and Reel; Package Quantity: 1; Termination: SMD/SMT; Number of Terminations: 2; Max Power Dissipation: 125mW; Voltage Rating (DC): 150V; Features: Moisture Resistant; Series: CR0805; Resistance Tolerance: 1%; Construction: Rectangular; Technology: THICK FILM; Length: 2mm; Width: 1.25mm; Height: 0.5mm; Depth: 1.25mm; Thickness: 508um; Radiation Hardening: No; REACH SVHC: No SVHC; Military Standard: Not; RoHS Compliant: Yes; ComponentLink1URL: https://datasheet.ciiva.com/11809/0900766b80fcdb72-11809178.pdf?src-supplier=RSComponents; ComponentLink1Description: https://datasheet.ciiva.com/11809/0900766b80fcdb72-11809178.pdf?src-supplier=RSComponents; ComponentLink2URL: https://datasheet.ciiva.com/6547/chpreztr-6547413.pdf?src-supplier=Digi-Key; ComponentLink2Description: https://datasheet.ciiva.com/6547/chpreztr-6547413.pdf?src-supplier=Digi-Key; ComponentLink3URL: https://datasheet.ciiva.com/6547/chpreztr-6547414.pdf?src-supplier=Digi-Key; ComponentLink3Description: https://datasheet.ciiva.com/6547/chpreztr-6547414.pdf?src-supplier=Digi-Key; ComponentLink4URL: https://datasheet.ciiva.com/6547/chpreztr-6547415.pdf?src-supplier=Digi-Key; ComponentLink4Description: https://datasheet.ciiva.com/6547/chpreztr-6547415.pdf?src-supplier=Digi-Key; ComponentLink5URL: https://datasheet.ciiva.com/9120/chpreztr-9120744.pdf?src-supplier=Avnet; ComponentLink5Description: https://datasheet.ciiva.com/9120/chpreztr-9120744.pdf?src-supplier=Avnet; Supplier Part Number 1: CR0805-FX-1000ELF
TP101-TP104 = CMP-00042-1: Test Point 1x1 mm; .SCHcheck: GP; Category: TestPoint; Source: e-Tech_Racing.SchLib; .Creator: GP; .PCBcheck: GP; Design Item ID: TestPoint
U101 U102 = CMP-031-00007-2: MPQ4323 – 42V LOAD DUMP, 3A, LOW IQ, SYNC STEP-DOWN CONVERTER, AEC-Q100; pin to pad: 1>2+10 2>9 3>4 4>6 5>1+11 6>5 7>8 8>7 9>12 10>3; Min Supply Voltage: 3.3V; Max Supply Voltage: 36V; Min Operating Temperature: -40°C; Case/Package: QFN12 (2mmx3mm); RoHS Compliant: Yes; Pins: 12; Max Operating Temperature: 150°C; Mounting Technology: SMD
U103 = LDO_10V-0.8/3V3-SOT223: LDO Regulator Pos 3.3V 0.8A 4-Pin(3+Tab) SOT-223 T/R / IC REG LDO 3.3V 0.8A SOT223; Manufacturer: Texas Instruments; Number of Outputs: 1; Max Input Voltage: 15V; Max Output Current: 800mA; Polarity: Positive; Quiescent Current: 15mA; Accuracy: 1%; Output Type: Fixed; Dropout Voltage: 1.2V; Min Input Voltage: 2.6V; Max Supply Voltage: 10V; Min Supply Voltage: 4.75V; Current Rating: 800A; .Creator: GP; ComponentLink1URL: https://www.ti.com/lit/ds/symlink/lm1117.pdf?HQS=dis-mous-null-mousermode-dsf-pf-null-wwe&DCM=yes&ref_url=https%3A%2F%2Fwww.mouser.de%2F&distId=26; ComponentLink1Description: Datasheet; ComponentLink2Description: Where buy it; ComponentLink2URL: https://www.mouser.es/ProductDetail/Texas-Instruments/LM1117IMP-33-NOPB?qs=X1J7HmVL2ZFbpN1TgOsjYQ%3D%3D; Supplier 1: Digi-Key; Manufacturer Part Number: LM1117IMP-3.3/NOPB; RoHS: Yes; Category: LDO; Pricing 1: 1=1,41000, 10=1,26300, 25=1,19920, 100=0,98500, 250=0,92072, 500=0,81366 (USD); Mount: Surface Mount; Case/Package: SOT-223; Number of Pins: 4; Min Operating Temperature: -40°C; Max Operating Temperature: 125°C; Output Voltage: 3.3V; Packaging: Tape and Reel; Output Current: 800mA; Nominal Output Voltage: 3.3V; Termination: SMD/SMT; Output Voltage Accuracy: 1%; Number of Regulators: 1; Min Current Limit: 800mA; Package Quantity: 1000; Length: 6.5mm; Width: 3.56mm; Height: 1.6mm; Radiation Hardening: No; REACH SVHC: No SVHC; Lead Free: Lead Free; RoHS Compliant: Yes; ComponentLink3URL: https://datasheet.ciiva.com/27051/1281318-27051810.pdf?src-supplier=Jameco; ComponentLink3Description: https://datasheet.ciiva.com/27051/1281318-27051810.pdf?src-supplier=Jameco; ComponentLink4URL: https://datasheet.ciiva.com/8042/1670636-8042261.pdf?src-supplier=Element14; ComponentLink4Description: https://datasheet.ciiva.com/8042/1670636-8042261.pdf?src-supplier=Element14; ComponentLink5URL: https://datasheet.ciiva.com/1570/1849796-1570171.pdf?src-supplier=Farnell; ComponentLink5Description: https://datasheet.ciiva.com/1570/1849796-1570171.pdf?src-supplier=Farnell; ComponentLink6URL: https://datasheet.ciiva.com/14149/lm1117-eng-tds-14149980.pdf?src-supplier=Distrelec; ComponentLink6Description: https://datasheet.ciiva.com/14149/lm1117-eng-tds-14149980.pdf?src-supplier=Distrelec; ComponentLink7URL: https://datasheet.ciiva.com/46386/1882372-46386042.pdf?src-supplier=Element14; ComponentLink7Description: https://datasheet.ciiva.com/46386/1882372-46386042.pdf?src-supplier=Element14; ComponentLink8URL: https://datasheet.ciiva.com/3223/lm1117-n-3223515.pdf?src-supplier=Avnet; ComponentLink8Description: https://datasheet.ciiva.com/3223/lm1117-n-3223515.pdf?src-supplier=Avnet; ComponentLink9URL: https://datasheet.ciiva.com/6580/lm1117-n-6580030.pdf?src-supplier=Digi-Key; ComponentLink9Description: https://datasheet.ciiva.com/6580/lm1117-n-6580030.pdf?src-supplier=Digi-Key; ComponentLink10URL: https://datasheet.ciiva.com/6580/lm1117-n-6580026.pdf?src-supplier=Digi-Key; ComponentLink10Description: https://datasheet.ciiva.com/6580/lm1117-n-6580026.pdf?src-supplier=Digi-Key; Supplier Part Number 1: LM1117IMP-3.3/NOPBCT-ND